# Altium schematic sheet USB.SchDoc
size A; SheetNumber: 11
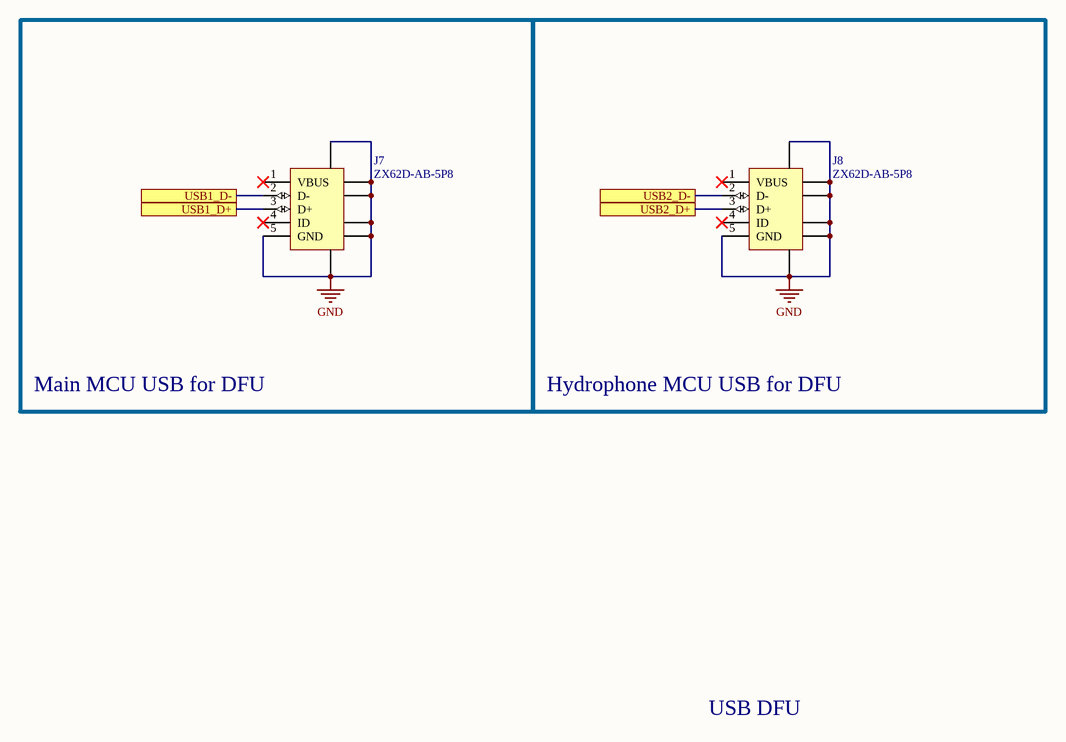
[diagram p0: USB.SchDoc]

## Parts
J7  ZX62D-AB-5P8  [HIRO-ZX62D-AB-5P8_V]
J8  ZX62D-AB-5P8  [HIRO-ZX62D-AB-5P8_V]

## Blocks framed on the sheet
Main MCU USB for DFU: J7
Hydrophone MCU USB for DFU: J8

## Ports
USB1_D+, USB1_D-, USB2_D+, USB2_D-

## Nets
GND: J7.5(GND) J7.6(SHLD) J7.7(SHLD) J7.8(SHLD) J7.9(SHLD) J7.10(SHLD) J7.11(SHLD) J8.5(GND) J8.6(SHLD) J8.7(SHLD) J8.8(SHLD) J8.9(SHLD) J8.10(SHLD) J8.11(SHLD)
USB1_D+: J7.3(D+) ; port USB1_D+
USB1_D-: J7.2(D-) ; port USB1_D-
USB2_D+: J8.3(D+) ; port USB2_D+
USB2_D-: J8.2(D-) ; port USB2_D-

Not connected (* = marked no-connect by the designer): J7 1(VBUS)* 4(ID)*; J8 1(VBUS)* 4(ID)*

## Notes on the sheet
- USB DFU

## Library data of the parts
J7 J8 = CMP-1349-00001-2: USB 2.0 Standard Micro-USB Connector, Micro AB-Standard (Bottom Mount), 30 V AC, -30 to 85 degC, Right Angle, 5-Pin 7.5 x 5.6 x 2.8 mm SMD, RoHS, Reel; Manufacturer: Hirose Electric; Number of Contacts: 5; Capacitance: 2 pF Max.; Voltage Rating: 30 V AC; Contact Resistance: 30 mOhm Max.; PartNumber: ZX62D-AB-5P8; Mounting Technology: Surface Mount; ComponentLink1URL: http://www.hirose.com/; ComponentLink2URL: http://www.hirose.co.jp/cataloge_hp/ed_ZX_20140804.pdf; ComponentLink1Description: Manufacturer URL; ComponentLink3Description: Package Specification; Operating Temperature Range: -30 to 85 degC; RoHS: TRUE; DatasheetVersion: Aug-14; PackageDescription: USB Micro-AB Connector, Right Angle, Body 7.5 x 5.6 mm, Pitch 0.65 mm, Height 2.8 mm; ComponentLink3URL: http://www.hirose.co.jp/cataloge_hp/ed_ZX_20140804.pdf; Packing: Reel; ComponentLink2Description: Datasheet